# Altium schematic sheet meca.SchDoc
size A3; Organization: EPI sarl; Address1: 153 rue d'Altorf; Address2: 67120; Address3: Dachstein; Address4: France; SheetNumber: 3; SheetTotal: 3
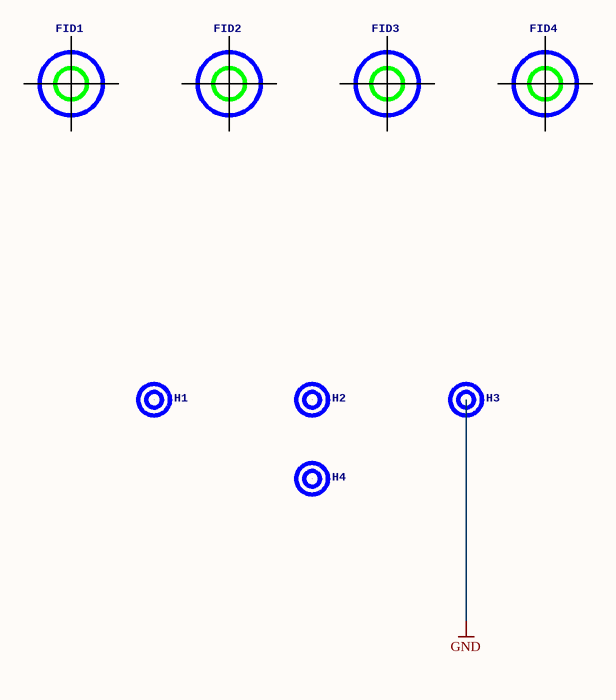
[diagram p0: meca.SchDoc]

## Parts
FID1  FIDUCIALROUND-1MM  [FID-1MM_V3]  (value not drawn)  (no BOM)
FID2  FIDUCIALROUND-1MM  [FID-1MM_V3]  (value not drawn)  (no BOM)
FID3  FIDUCIALROUND-1MM  [FID-1MM_V3]  (value not drawn)  (no BOM)
FID4  FIDUCIALROUND-1MM  [FID-1MM_V3]  (value not drawn)  (no BOM)
H1  SCREW-PTH_M3  [SCREW-TCHC-M3-PTH-via]  (value not drawn)
H2  SCREW-PTH_M3  [SCREW-TCHC-M3-PTH-via]  (value not drawn)
H3  SCREW-PTH_M3  [SCREW-TCHC-M3-PTH-via]  (value not drawn)
H4  SCREW-PTH_M3  [SCREW-TCHC-M3-PTH-via]  (value not drawn)

## Nets
GND: H3.1

Not connected (* = marked no-connect by the designer): H1 1; H2 1; H4 1

## Notes on the sheet
- Unless otherwise noted, this document contains EPI® technologies information.
- Exclusive Property of EPI®
- File :
- Size:
- Date:
- A3
- Ref :
- Sheet
- of
- Reproduction, use, disclosure or transmittal of all or any part of this document is prohibited except to the explicit approved in writing by EPI® representative.
- Project :

## Library data of the parts
FID1-FID4 = FIDUCIALROUND-1MM: MPN: ??; GateName_1: G$1; ENO_PN: LOC0001; INFO: no mounted; SymbolName_1: FIDUCIAL; DeviceName: ROUND-1MM; LibraryName: marker-eno; DeviceSetName: FIDUCIAL; Package: FIDUCIAL-1MM; CASE: ??
H1-H4 = SCREW-PTH_M3: GateName_1: G$1; SymbolName_1: SCREW; DeviceName: M3; 3DPACKAGE: NO; ENO_PN: SCR0001; INFO: Standard CHC M3; MF: GENERIC; LibraryName: screw-eno; DeviceSetName: SCREW-PTH_; Package: SCREW-TCHC-M3-PTH